# Altium schematic sheet SelfBalancingCar.SchDoc
size A2; SheetNumber: 1; SheetTotal: 1
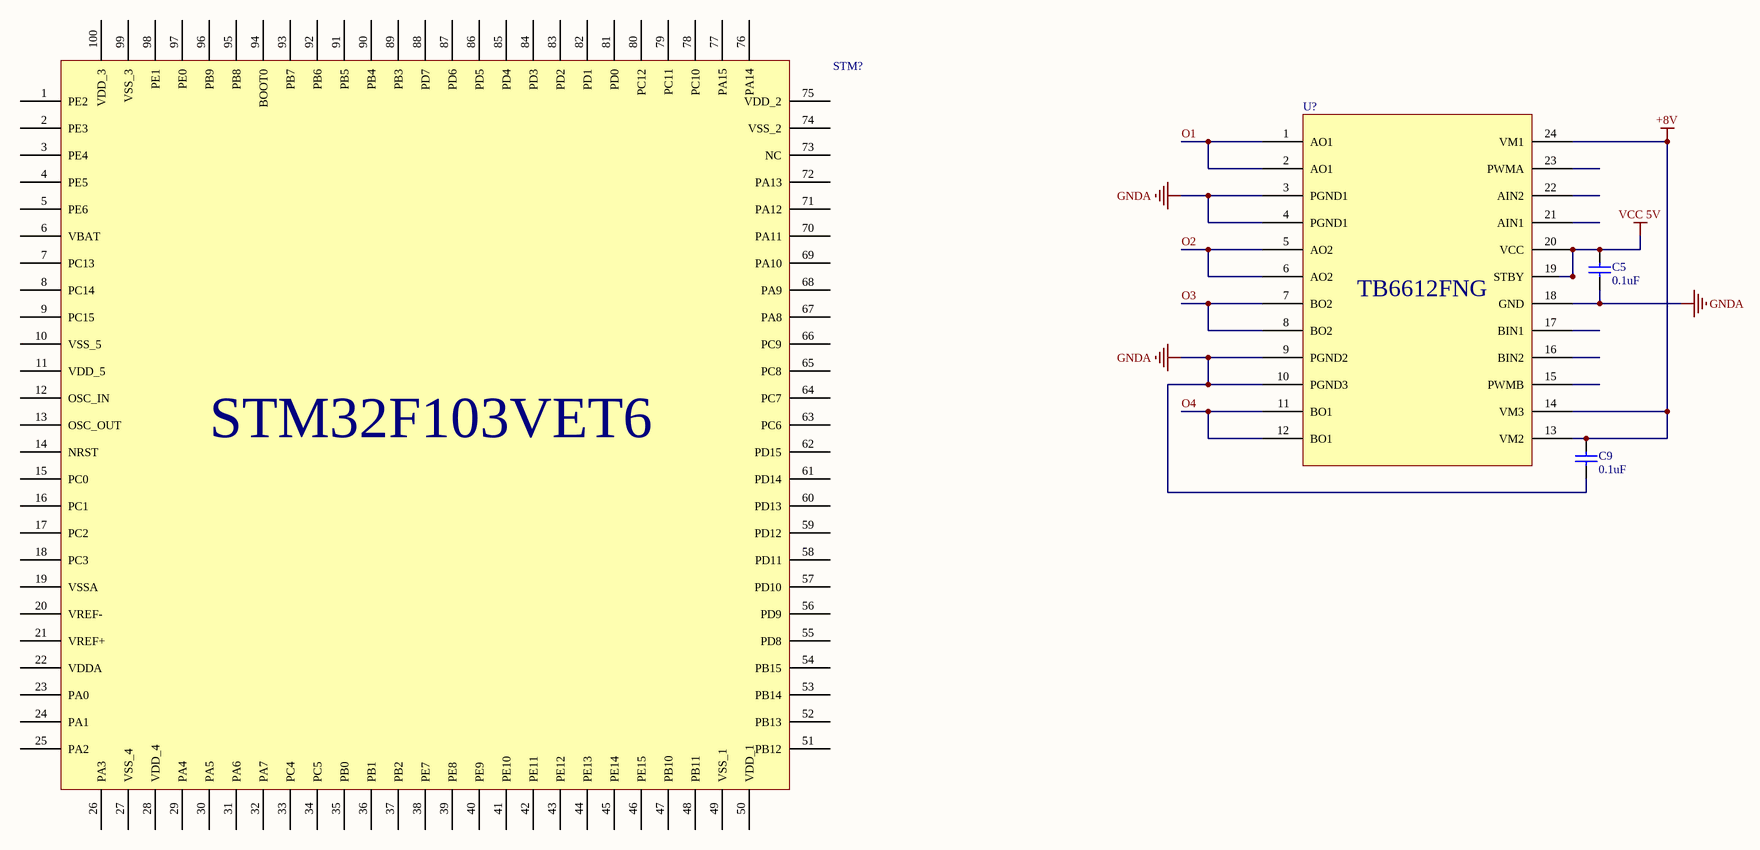
[diagram p0: SelfBalancingCar.SchDoc]

## Parts
C5  0.1uF  [0603电容]
C9  0.1uF  [0603电容]
STM?  STM32F103VET6  [LQFP 100]  (value not drawn)
U?  TB6612FNG  [TB6612]

## Nets
+8V: C9.1 U?.13(VM2) U?.14(VM3) U?.24(VM1)
GNDA: C5.2 C9.2 U?.3(PGND1) U?.4(PGND1) U?.9(PGND2) U?.10(PGND3) U?.18(GND)
VCC 5V: C5.1 U?.19(STBY) U?.20(VCC)
O1: U?.1(AO1) U?.2(AO1)
O2: U?.5(AO2) U?.6(AO2)
O3: U?.7(BO2) U?.8(BO2)
O4: U?.11(BO1) U?.12(BO1)

Not connected (* = marked no-connect by the designer): STM? 1(PE2) 2(PE3) 3(PE4) 4(PE5) 5(PE6) 6(VBAT) 7(PC13) 8(PC14) 9(PC15) 10(VSS_5) 11(VDD_5) 12(OSC_IN) 13(OSC_OUT) 14(NRST) 15(PC0) 16(PC1) 17(PC2) 18(PC3) 19(VSSA) 20(VREF-) 21(VREF+) 22(VDDA) 23(PA0) 24(PA1) 25(PA2) 26(PA3) 27(VSS_4) 28(VDD_4) 29(PA4) 30(PA5) 31(PA6) 32(PA7) 33(PC4) 34(PC5) 35(PB0) 36(PB1) 37(PB2) 38(PE7) 39(PE8) 40(PE9) 41(PE10) 42(PE11) 43(PE12) 44(PE13) 45(PE14) 46(PE15) 47(PB10) 48(PB11) 49(VSS_1) 50(VDD_1) 51(PB12) 52(PB13) 53(PB14) 54(PB15) 55(PD8) 56(PD9) 57(PD10) 58(PD11) 59(PD12) 60(PD13) 61(PD14) 62(PD15) 63(PC6) 64(PC7) 65(PC8) 66(PC9) 67(PA8) 68(PA9) 69(PA10) 70(PA11) 71(PA12) 72(PA13) 73(NC) 74(VSS_2) 75(VDD_2) 76(PA14) 77(PA15) 78(PC10) 79(PC11) 80(PC12) 81(PD0) 82(PD1) 83(PD2) 84(PD3) 85(PD4) 86(PD5) 87(PD6) 88(PD7) 89(PB3) 90(PB4) 91(PB5) 92(PB6) 93(PB7) 94(BOOT0) 95(PB8) 96(PB9) 97(PE0) 98(PE1) 99(VSS_3) 100(VDD_3); U? 15(PWMB) 16(BIN2) 17(BIN1) 21(AIN1) 22(AIN2) 23(PWMA)

## Library data of the parts
C5 C9 = Cap: Capacitor; Published: 8-Jun-2000; LatestRevisionDate: 17-Jul-2002; LatestRevisionNote: Re-released for DXP Platform.; PackageReference: RAD-0.3; Publisher: Altium Limited; PackageDescription: Radial Cap, Thru-Hole; 2 Leads; 0.3 in Pin Spacing; Value: 0.1uF